# Altium schematic sheet CATS-GS-USB.SchDoc: CATS Groundstation
size A4; DocumentNumber: Overview; Revision: V1.0; SheetNumber: 5; SheetTotal: 9; Author: Luca Jost; Subtitle: USB Connector
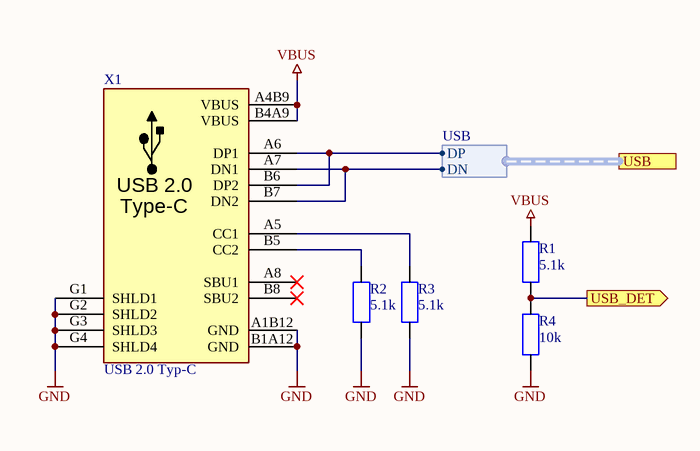
[diagram p0: CATS-GS-USB.SchDoc]

## Parts
R1  5.1k  [SMD Widerstand 0402]
R2  5.1k  [SMD Widerstand 0402]
R3  5.1k  [SMD Widerstand 0402]
R4  10k  [SMD Widerstand 0402]
X1  USB 2.0 Typ-C  [THT USB-C Socket (A40-00119)]

## Ports
USB (harness USB), USB_DET (out)

## Harnesses
USB: DP, DN

## Nets
GND: R2.1 R3.1 R4.2 X1.A1B12(GND) X1.B1A12(GND) X1.G1(SHLD1) X1.G2(SHLD2) X1.G3(SHLD3) X1.G4(SHLD4)
VBUS: R1.1 X1.A4B9(VBUS) X1.B4A9(VBUS)
USB_DET: R1.2 R4.1 ; port USB_DET
NetR2_2: R2.2 X1.B5(CC2)
NetR3_2: R3.2 X1.A5(CC1)
NetX1_A6: X1.A6(DP1) X1.B6(DP2) ; port USB.DP
NetX1_A7: X1.A7(DN1) X1.B7(DN2) ; port USB.DN

Not connected (* = marked no-connect by the designer): X1 A8(SBU1)* B8(SBU2)*

## Notes on the sheet
- Title
- Author:
- Subtitle
- Date:
- Rev:
- File:
- Sheet
- of
- (in symbol USB Type-C USB 2.0) USB 2.0; Type-C

## Library data of the parts
R1-R3 = E24 - 5.1k: SMD Chip Resistor E24; Unit Price: 0.01; Number: -; Supplier: -; JLC: C25905
R4 = E24 - 10k: SMD Chip Resistor E24; Unit Price: 0.01; Number: -; Supplier: -; JLC: C25744
X1 = USB Type-C USB 2.0: Typ-C; aliExpress: 33045191307; Digikey: 2073-USB4105-GF-ACT-ND; Farnell: 3583366; JLC: C167321